# Altium schematic sheet Control Interface.SchDoc
size A; SheetNumber: 19; SheetTotal: 19
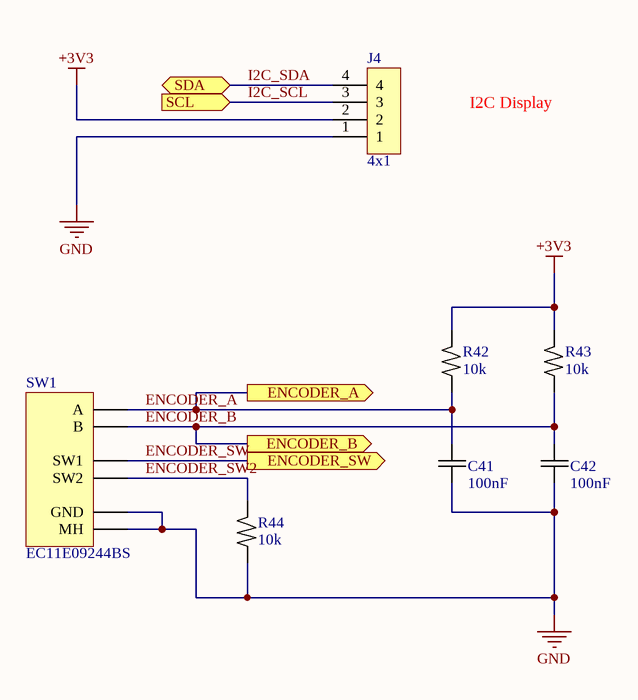
[diagram p0: Control Interface.SchDoc]

## Parts
C41  100nF  [C0603]
C42  100nF  [C0603]
J4  4x1  [Female Header 4x1 2.54mm]
R42  10k  [R0603]
R43  10k  [R0603]
R44  10k  [R0603]
SW1  EC11E09244BS  [EC11E09244BS Encoder]

## Ports
ENCODER_A (out), ENCODER_B (out), ENCODER_SW (out), SCL (in), SDA (bidir)

## Nets
+3V3: J4.2 R42.2 R43.2
GND: C41.1 C42.1 J4.1 R44.1 SW1.C(GND) SW1.MH
ENCODER_A: C41.2 R42.1 SW1.A ; port ENCODER_A
ENCODER_B: C42.2 R43.1 SW1.B ; port ENCODER_B
ENCODER_SW: SW1.D(SW1) ; port ENCODER_SW
ENCODER_SW2: R44.2 SW1.E(SW2)
I2C_SCL: J4.3 ; port SCL
I2C_SDA: J4.4 ; port SDA

## Notes on the sheet
- I2C Display
- Project:
- Sheet Title:
- Size
- Date:
- A
- Sheet Number:
- Sheet Total:
- Revision:
- Time:
- Author:

## Library data of the parts
C41 C42 = Cap_cer: CAP CER 100nF 50V X7R 0603; MF: HRE; MP: CGA0603X7R104K500JT; ComponentLink1Description: Datasheet; ComponentLink1URL: https://www.lcsc.com/datasheet/C6119867.pdf; ComponentLink2Description: Supplier1; ComponentLink2URL: https://www.lcsc.com/product-detail/C6119867.html
J4 = Pin Header Female 4x1 2.54mm: CONN SOCKET 4POS 2.54mm SINGLE ROW TH; MF: BOOMELE(Boom Precision Elec); MP: 2.54-1*4P; ComponentLink1Description: Datasheet; ComponentLink1URL: https://www.lcsc.com/datasheet/C2718488.pdf; ComponentLink2Description: Supplier1; ComponentLink2URL: https://www.lcsc.com/product-detail/C2718488.html
R42-R44 = Res: RES 10kΩ ±1% 100mW 0603; MF: FOJAN; MP: FRC0603F1002TS; ComponentLink1Description: Datasheet; ComponentLink1URL: https://www.lcsc.com/datasheet/C2906982.pdf; ComponentLink2Description: Supplier1; ComponentLink2URL: https://www.lcsc.com/product-detail/C2906982.html
SW1 = EC11E09244BS Encoder: Through Hole Encoders RoHS; MF: ALPSALPINE; MP: EC11E09244BS; ComponentLink1Description: Supplier1; ComponentLink1URL: https://www.lcsc.com/product-detail/C470742.html; ComponentLink2Description: Datasheet; ComponentLink2URL: https://www.lcsc.com/datasheet/C470742.pdf